# EAGLE design Charger_LM317 (EAGLE 7.6.0)
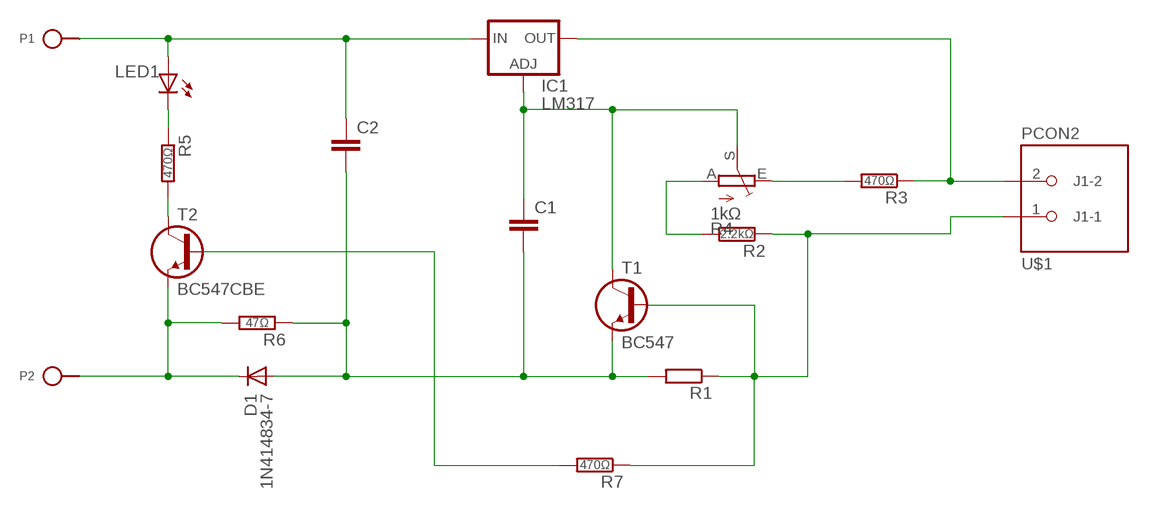
[diagram p0: schematic, sheet 1]

## Parts
C1  C050-020X036  [C050-020X036]
C2  C050-020X036  [C050-020X036]
D1  1N414834-7  [DO34-7]
IC1  LM317  LM317TL  [317TL]
LED1  LED5MM  [LED5MM]
P1  +  SPAD  [SPAD]
P2  -  SPAD  [SPAD]
R1  R0207/7  [0207/7]
R2  2.2kΩ  R0202/5  [0202/5]
R3  470Ω  R0202/7  [0202/7]
R4  1kΩ  TRIM_EU-B25P  [B25P]
R5  470Ω  R0202/7  [0202/7]
R6  47Ω  R0202/7  [0202/7]
R7  470Ω  R0202/7  [0202/7]
T1  BC547  BC547CBE  [TO92-CBE]
T2  BC547CBE  [TO92-CBE]
U$1  PCON2  [CON-2PIN]

## Nets
ADJ: C1.1 IC1.1(ADJ) R4.S T1.C
GND: D1.C P2.1 R6.2 T2.E
GND-: C1.2 C2.2 D1.A R1.2 R6.1 T1.E
N$1: R3.2 R4.E
N$5: R2.2 R4.A
N$8: R5.2 T2.C
N$9: LED1.K(C) R5.1
N$12: R7.2 T2.B
OUT+: IC1.2(OUT) R3.1 U$1.2(J1-2)
OUT-: R1.1 R2.1 R7.1 T1.B U$1.1(J1-1)
VCC: C2.1 IC1.3(IN) LED1.A P1.1

## Library data of the parts
C1 C2 = c:C: CAPACITOR, European symbol
D1 = d:1N4148
IC1 = v-reg:LM317TL: VOLTAGE REGULATOR
LED1 = led:LED: LED OSRAM: - CHIPLED LG R971, LG N971, LY N971, LG Q971, LY Q971, LO R971, LY R971 LH N974, LH R974 LS Q976, LO Q976, LY Q976 LO Q996 - Hyper CHIPLED LW Q18S LB Q993, LB Q99A, LB R99A - SideLED LS A670, LO A670, LY A670, LG A670, LP A670 LB A673, LV A673, LT A673, LW A673 LH A674 LY A675 LS A676, LA A676, LO A676, LY A676, LW A676 LS A679, LY A679, LG A679 - Hyper Micro SIDELED® LS Y876, LA Y876, LO Y876, LY Y876 LT Y87S - SmartLED LW L88C, LW L88S LB L89C, LB L89S, LG L890 LS L89K, LO L89K, LY L89K LS L896, LA L896, LO L896, LY L896 - TOPLED LS T670, LO T670, LY T670, LG T670, LP T670 LSG T670, LSP T670, LSY T670, LOP T670, LYG T670 LG T671, LOG T671, LSG T671 LB T673, LV T673, LT T673, LW T673 LH T674 LS T676, LA T676, LO T676, LY T676, LB T676, LH T676, LSB T676, LW T676 LB T67C, LV T67C, LT T67C, LS T67K, LO T67K, LY T67K, LW E67C LS E67B, LA E67B, LO E67B, LY E67B, LB E67C, LV E67C, LT E67C LW T67C LS T679, LY T679, LG T679 LS T770, LO T770, LY T770, LG T770, LP T770 LB T773, LV T773, LT T773, LW T773 LH T774 LS E675, LA E675, LY E675, LS T675 LS T776, LA T776, LO T776, LY T776, LB T776 LHGB T686 LT T68C, LB T68C - Hyper Mini TOPLED® LB M676 - Mini TOPLED Santana® LG M470 LS M47K, LO M47K, LY M47K Source: http://www.osram.convergy.de LUXEON: - LUMILED® LXK2-PW12-R00, LXK2-PW12-S00, LXK2-PW14-U00, LXK2-PW14-V00 LXK2-PM12-R00, LXK2-PM12-S00, LXK2-PM14-U00 LXK2-PE12-Q00, LXK2-PE12-R00, LXK2-PE12-S00, LXK2-PE14-T00, LXK2-PE14-U00 LXK2-PB12-K00, LXK2-PB12-L00, LXK2-PB12-M00, LXK2-PB14-N00, LXK2-PB14-P00, LXK2-PB14-Q00 LXK2-PR12-L00, LXK2-PR12-M00, LXK2-PR14-Q00, LXK2-PR14-R00 LXK2-PD12-Q00, LXK2-PD12-R00, LXK2-PD12-S00 LXK2-PH12-R00, LXK2-PH12-S00 LXK2-PL12-P00, LXK2-PL12-Q00, LXK2-PL12-R00 Source: www.luxeon.com KINGBRIGHT: KA-3528ASYC Source: www.kingbright.com
P1 P2 = pad:SPAD
R1-R3 R5-R7 = r:R: RESISTOR, European symbol
R4 = pot:TRIM_EU-: POTENTIOMETER
T1 T2 = t:BC547
U$1 = print-conn:PCON2

## Board
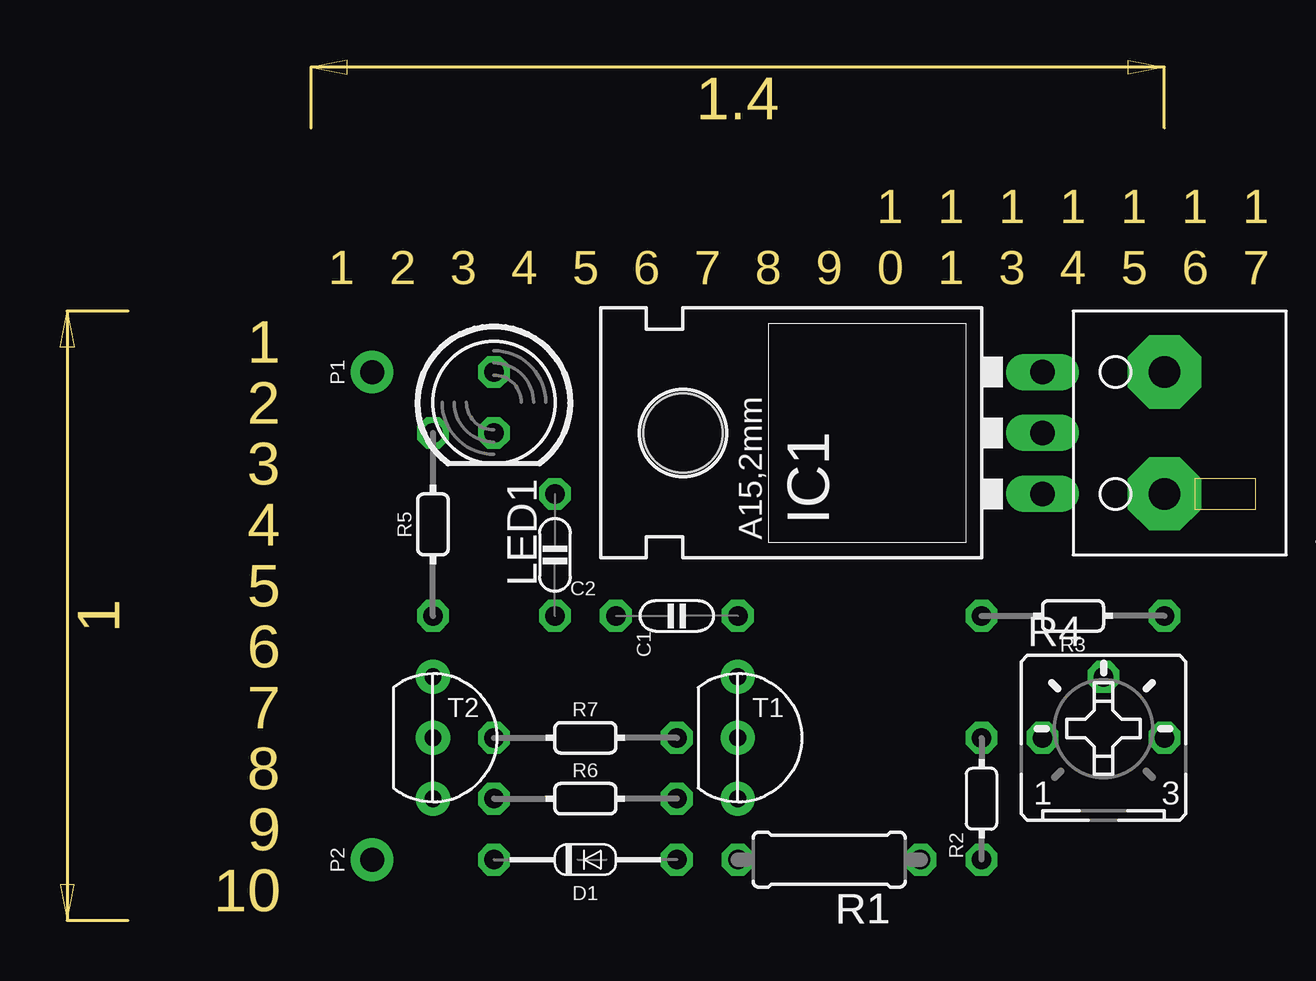
[diagram p1: board, top side]
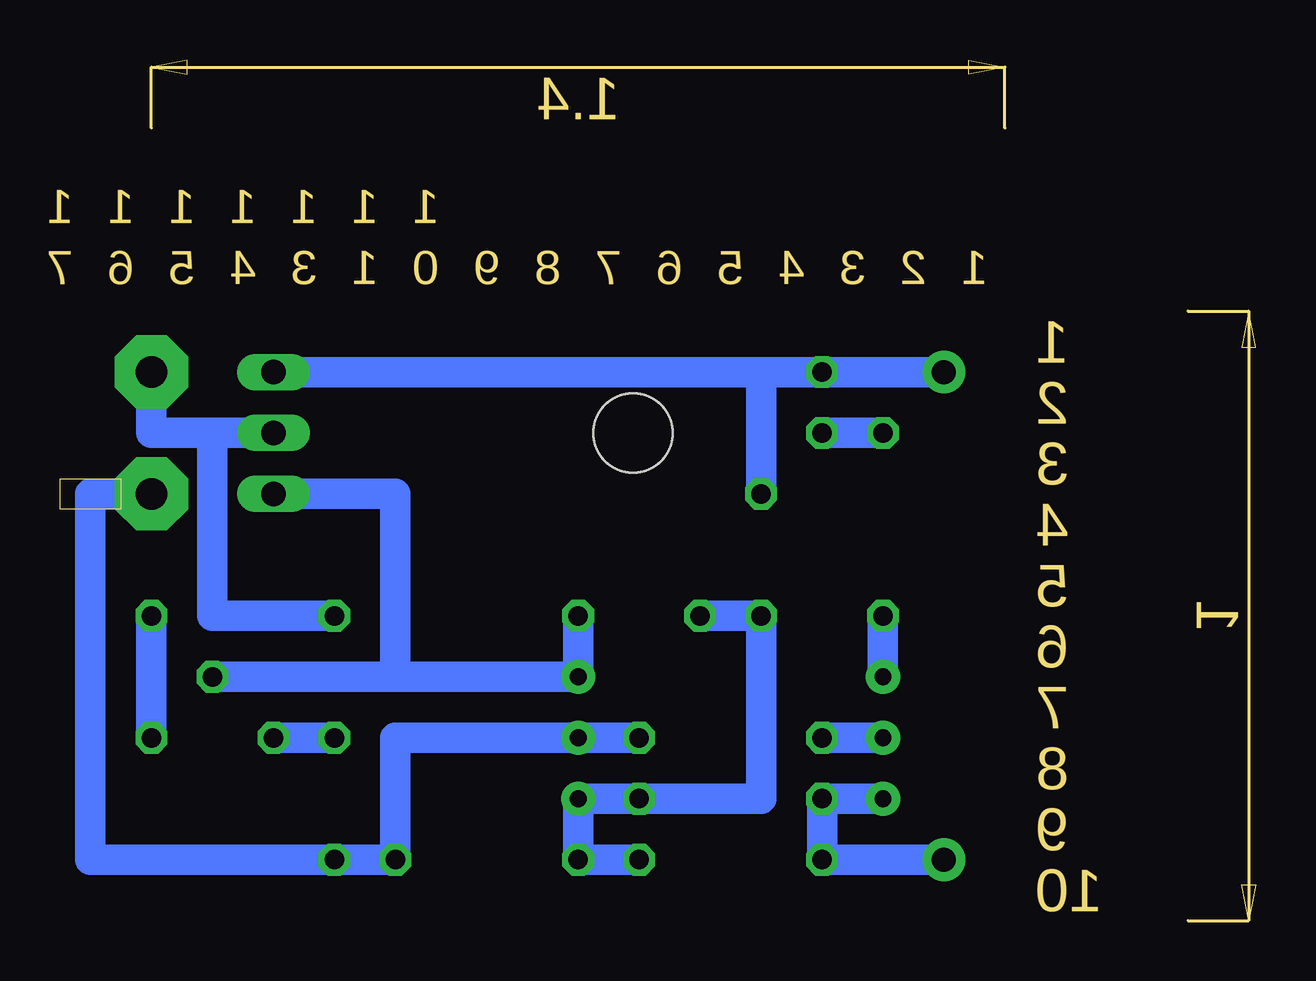
[diagram p2: board, bottom side, seen from below]

Size 2.54 x 1.27 mm. Coordinates in mm from the lower left corner, seen from the top.
Copper layers (1*16): Top 0.035mm / dielectric 1.5mm / Bottom 0.035mm
Design rules "default": minimum track width 10mil, minimum drill 24mil, track to track 8mil, track to pad 8mil, pad to pad 8mil, via to via 8mil, smd to smd 8mil, copper to edge 40mil, drill to drill 8mil, minimum pad ring 10mil, minimum via ring 8mil, stop-mask expansion 4mil, vias tented up to drill 0mil, thermal gap 10mil

### Footprints (pad centres in the part's own frame; a part is rotated, then mirrored left to right if it is on the bottom)
C050-020X036 = drill 0.813 octagon: 1 0,-2.54; 2 0,2.54
DO34-7 = drill 0.813 octagon: A -3.81,0; C 3.81,0
317TL = drill 1.016 long: 1 -2.54,-3.81; 2 0,-3.81; 3 2.54,-3.81 | hole 3.302: 0,11.176
LED5MM = drill 0.813 octagon: A -1.27,0; K 1.27,0
SPAD = drill 1 pad 1.778: 1 0,0
0207/7 = drill 0.813 octagon: 1 -3.81,0; 2 3.81,0
0202/5 = drill 0.813 octagon: 1 -2.54,0; 2 2.54,0
0202/7 = drill 0.813 octagon: 1 -3.81,0; 2 3.81,0
B25P = drill 0.813 octagon: A -2.54,0; E 2.54,0; S 0,2.54
TO92-CBE = drill 0.7 pad 1.422: B 0,0; C 0,2.54; E 0,-2.54
CON-2PIN = drill 1.3 pad 3.048 octagon: 1 -2.54,0; 2 2.54,0

### Placement (x,y rotation side)
C1  -21.59,-4.45 90 top  (outside the outline)
C2  -26.67,-1.9 180 top  (outside the outline)
D1  -25.4,-14.61 180 top  (outside the outline)
IC1  -10.16,3.18 90 top  (outside the outline)
LED1  -29.21,4.45 270 top  (outside the outline)
P1  -34.29,5.71 0 top  (outside the outline)
P2  -34.29,-14.61 0 top  (outside the outline)
R1  -15.24,-14.61 180 top  (outside the outline)
R2  -8.89,-12.06 90 top  (outside the outline)
R3  -5.08,-4.45 0 top  (outside the outline)
R4  -3.81,-9.52 0 top  (outside the outline)
R5  -31.75,-0.63 270 top  (outside the outline)
R6  -25.4,-12.06 180 top  (outside the outline)
R7  -25.4,-9.52 180 top  (outside the outline)
T1  -19.05,-9.52 0 top  (outside the outline)
T2  -31.75,-9.52 0 top  (outside the outline)
U$1  -1.27,3.18 90 top

### Tracks (layer width: path | path; a pad name or v marks a point on that pad's centre or on a via)
ADJ
  Bottom 1.27: IC1.1 -11.43,0.64 -11.43,-6.98 | -11.43,-6.98 R4.S | C1.1 T1.C -11.43,-6.98
GND
  Bottom 1.27: P2.1 D1.C R6.2 T2.E
GND-
  Bottom 1.27: C1.2 C2.2 -26.67,-12.06 R6.1 T1.E R1.2 D1.A
N$1
  Bottom 1.27: R3.2 R4.E
N$5
  Bottom 1.27: R4.A R2.2
N$8
  Bottom 1.27: T2.C R5.2
N$9
  Bottom 1.27: R5.1 LED1.K
N$12
  Bottom 1.27: T2.B R7.2
OUT+
  Bottom 1.27: R3.1 -3.81,-4.45 -3.81,3.18 | IC1.2 -3.81,3.18 | -3.81,3.18 -1.27,3.18 U$1.2
OUT-
  Bottom 1.27: R7.1 T1.B -11.43,-9.52 R1.1 R2.1 1.27,-14.61 1.27,0.64 U$1.1
VCC
  Bottom 1.27: P1.1 LED1.A -26.67,5.71 | IC1.3 -26.67,5.71 | C2.1 -26.67,5.71

### Text on the board
Dimension: 1 | 1 | 1 | 1 | 1 | 1 | 1 | 1 | 2 | 3 | 4 | 5 | 6 | 7 | 8 | 9 | 0 | 1 | 3 | 4 | 5 | 6 | 7 | 1 | 2 | 3 | 4 | 5 | 6 | 7 | 8 | 9 | 10